# EAGLE schematic Digispark_Neopixel_Button_Cycler (EAGLE 6.5.0)
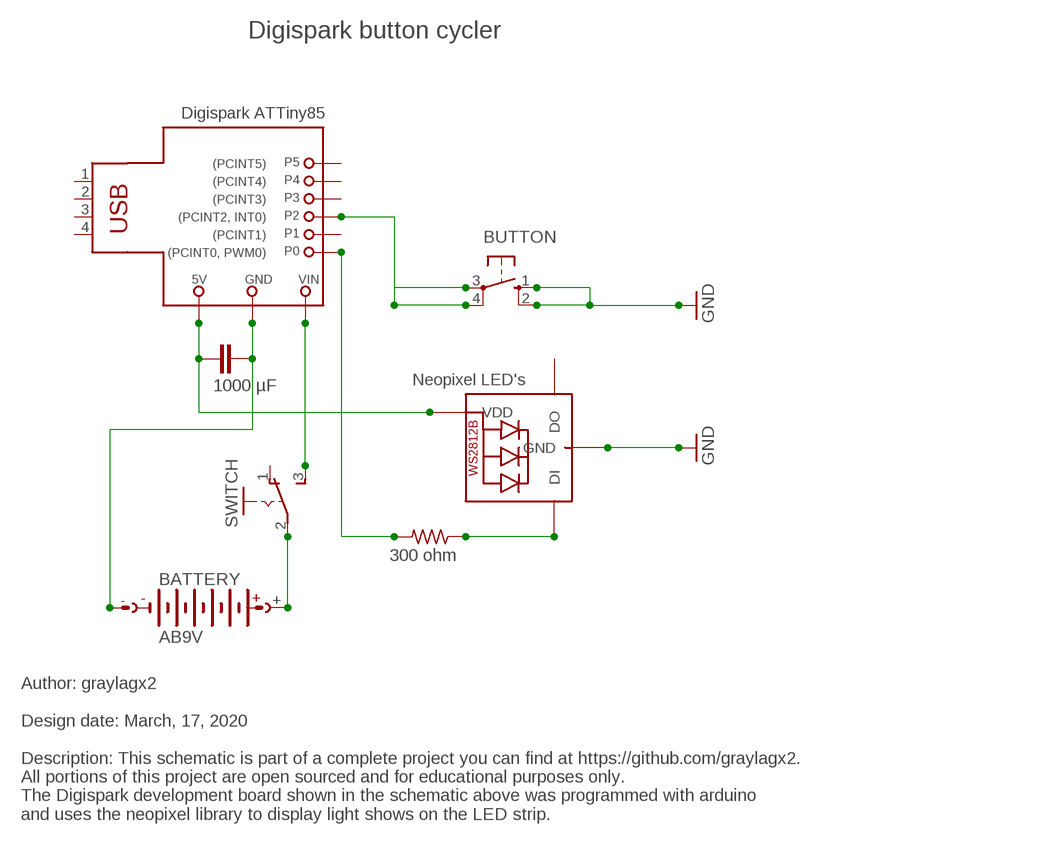
[diagram p0: schematic, sheet 1]

## Parts
BATTERY  AB9V  [AB9V]
BUTTON  10-XX  [B3F-10XX]
C1  1000 µF  C2.5/2  [C2.5-2]
LED1  WS2812B5050  [WS2812B]
R1  300 ohm  R-US_0207/12  [0207/12]
SWITCH  255SB  [255SB]
X1  PN87520  [PN87520]

## Nets
GND: BUTTON.1(S) BUTTON.2(S1) LED1.3-GND(GND)
N$1: LED1.4-DIN(DI) R1.1
N$2: BUTTON.3(P) BUTTON.4(P1)
N$3: C1.2 LED1.1-VDD(VDD)
N$4: BATTERY.- C1.1
N$5: BATTERY.+ SWITCH.2(P)
N$6: R1.2
N$7: SWITCH.3(S)
Unconnected: LED1.2-DOUT(DO) SWITCH.1(O) X1.1 X1.2 X1.3 X1.4

## Notes on the sheet
- Digispark button cycler
- Digispark ATTiny85
- (PCINT5) | DIO
- P5
- (PCINT4) | DIO
- P4
- (PCINT3) | DIO
- P3
- (PCINT2, INT0) | DIO
- P2
- (PCINT1) | DIO
- P1
- (PCINT0, PWM0) | DIO
- P0
- 5V | GND | VIN
- pwr 0 | sup
- pwr
  (9-16v)
- Neopixel LED's
- Author: graylagx2
  
  Design date: March, 17, 2020
  
  Description: This schematic is part of a complete project you can find at https://github.com/graylagx2.
  All portions of this project are open sourced and for educational purposes only.
  The Digispark development board shown in the schematic above was programmed with arduino
  and uses the neopixel library to display light shows on the LED strip.

## Library data of the parts
BATTERY = battery:AB9V: 9-V BATTERY CLIP
BUTTON = switch-omron:10-XX: OMRON SWITCH; MPN: B3F-1000; OC_FARNELL: 176432; OC_NEWARK: 36M3542
C1 = capacitor-wima:C: CAPACITOR naming: grid - package width
LED1 = adafruit:WS2812B
R1 = resistor:R-US_: RESISTOR, American symbol
SWITCH = switch:255SB: SLIDING SWITCH Distributor Buerklin, 11G810
X1 = con-berg:PN87520: BERG USB connector; OC_FARNELL: unknown; OC_NEWARK: unknown